# Altium schematic sheet 练习1.SchDoc
size A4
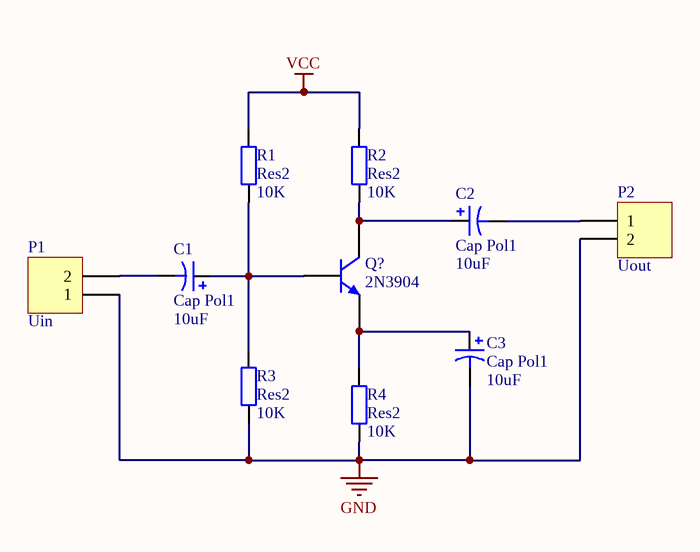
[diagram p0: 练习1.SchDoc]

## Parts
C1  Cap Pol1  value 10uF  [RB7.6-15]
C2  Cap Pol1  value 10uF  [RB7.6-15]
C3  Cap Pol1  value 10uF  [RB7.6-15]
P1  Uin  [HDR1X2]
P2  Uout  [HDR1X2]
Q?  2N3904  [TO-92A]
R1  Res2  value 10K  [AXIAL-0.4]
R2  Res2  value 10K  [AXIAL-0.4]
R3  Res2  value 10K  [AXIAL-0.4]
R4  Res2  value 10K  [AXIAL-0.4]

## Nets
GND: C3.2 P1.1 P2.2 R3.1 R4.1
VCC: R1.1 R2.2
NetC1_1: C1.1 Q?.2(B) R1.2 R3.2
NetC1_2: C1.2 P1.2
NetC2_1: C2.1 Q?.3(C) R2.1
NetC2_2: C2.2 P2.1
NetC3_1: C3.1 Q?.1(E) R4.2

## Library data of the parts
C1-C3 = Cap Pol1: Polarized Capacitor (Radial); Published: 8-Jun-2000; LatestRevisionDate: 17-Jul-2002; LatestRevisionNote: Re-released for DXP Platform.; PackageReference: RB7.6-15; Publisher: Altium Limited; PackageDescription: Polarized Capacitor (Radial); 2 Leads
P1 P2 = Header 2: Header, 2-Pin; LatestRevisionDate: 17-Jul-2002; LatestRevisionNote: Re-released for DXP Platform.; Publisher: Altium Limited
Q? = 2N3904: NPN General Purpose Amplifier; Published: 8-Jun-2000; LatestRevisionDate: 15-Jan-2003; LatestRevisionNote: PCB Footprint 'BCY-W3/D4.7' replaced; DatasheetVersion: 1997; PackageVersion: Sep-1998; PackageReference: TO-92A; Publisher: Altium Limited; PackageDescription: TO, Flat Index; 3 In-Line, Axial Leads; Body Dia. 4.5mm; Leads 0.51 x 0.48 mm (max); ComponentLink1Description: Manufacturer Link; ComponentLink1URL: http://www.fairchildsemi.com/; ComponentLink2Description: Datasheet; ComponentLink2URL: http://www.fairchildsemi.com/ds/2N%2F2N3904.pdf
R1-R4 = Res2: Resistor; Published: 8-Jun-2000; LatestRevisionDate: 17-Jul-2002; LatestRevisionNote: Re-released for DXP Platform.; PackageReference: AXIAL-0.4; Publisher: Altium Limited; PackageDescription: Axial Device, Thru-Hole; 2 Leads; 0.4 in Pin Spacing